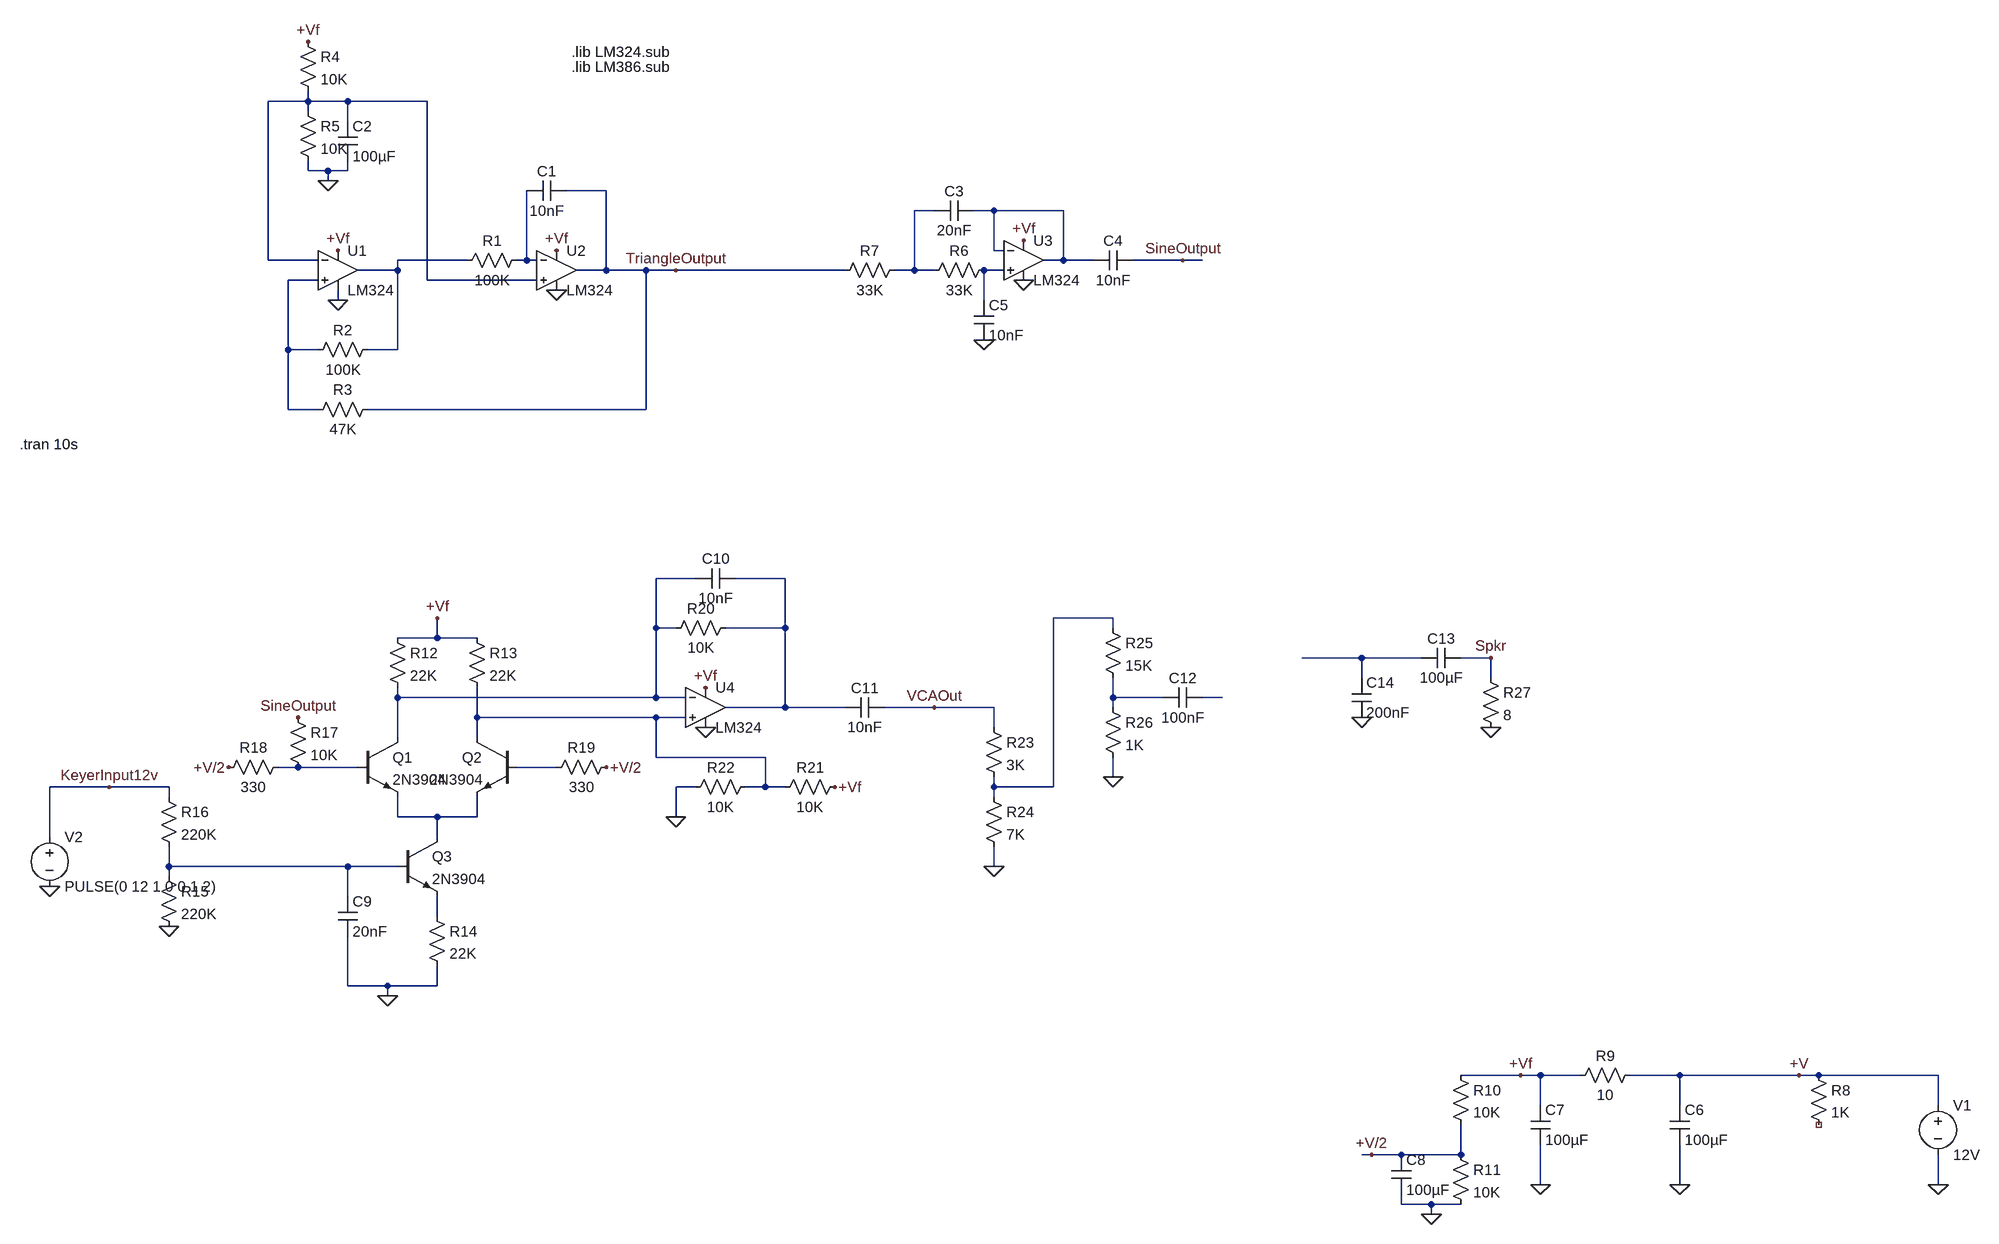
[diagram p0: schematic ClicklessOscilator.asc]
ClicklessOscilator.asc, the LTspice schematic file:
Version 4
SHEET 1 2764 1652
WIRE 32 -160 32 -176
WIRE 32 -160 -32 -160
WIRE 96 -160 32 -160
WIRE 224 -160 96 -160
WIRE 32 -144 32 -160
WIRE 96 -128 96 -160
WIRE 32 -48 32 -64
WIRE 64 -48 32 -48
WIRE 96 -48 96 -64
WIRE 96 -48 64 -48
WIRE 64 -32 64 -48
WIRE 512 -16 448 -16
WIRE 1040 16 1008 16
WIRE 1136 16 1104 16
WIRE 1248 16 1136 16
WIRE 1136 80 1136 16
WIRE 1152 80 1136 80
WIRE -32 96 -32 -160
WIRE 48 96 -32 96
WIRE 288 96 176 96
WIRE 384 96 384 -16
WIRE 384 96 368 96
WIRE 400 96 384 96
WIRE 1248 96 1248 16
WIRE 1248 96 1216 96
WIRE 1296 96 1248 96
WIRE 1440 96 1360 96
WIRE 1472 96 1440 96
WIRE 176 112 176 96
WIRE 176 112 112 112
WIRE 512 112 512 -16
WIRE 512 112 464 112
WIRE 576 112 512 112
WIRE 624 112 576 112
WIRE 896 112 624 112
WIRE 1008 112 1008 16
WIRE 1008 112 976 112
WIRE 1040 112 1008 112
WIRE 1152 112 1120 112
WIRE 48 128 0 128
WIRE 224 128 224 -160
WIRE 400 128 224 128
WIRE 80 160 80 144
WIRE 1120 160 1120 112
WIRE 0 240 0 128
WIRE 48 240 0 240
WIRE 176 240 176 112
WIRE 176 240 128 240
WIRE 0 336 0 240
WIRE 48 336 0 336
WIRE 576 336 576 112
WIRE 576 336 128 336
WIRE 656 608 592 608
WIRE 800 608 720 608
WIRE 1328 672 1232 672
WIRE 592 688 592 608
WIRE 624 688 592 688
WIRE 800 688 800 608
WIRE 800 688 704 688
WIRE 1328 688 1328 672
WIRE 240 704 240 672
WIRE 240 704 176 704
WIRE 304 704 240 704
WIRE 1728 736 1632 736
WIRE 1824 736 1728 736
WIRE 1936 736 1888 736
WIRE 1728 768 1728 736
WIRE 1936 768 1936 736
WIRE 176 800 176 784
WIRE 592 800 592 688
WIRE 592 800 176 800
WIRE 640 800 592 800
WIRE 1328 800 1328 768
WIRE 1408 800 1328 800
WIRE 1504 800 1472 800
WIRE 800 816 800 688
WIRE 800 816 704 816
WIRE 896 816 800 816
WIRE 1040 816 960 816
WIRE 1136 816 1040 816
WIRE 1328 816 1328 800
WIRE 304 832 304 784
WIRE 592 832 304 832
WIRE 640 832 592 832
WIRE 1136 848 1136 816
WIRE 176 864 176 800
WIRE 304 864 304 832
WIRE 592 896 592 832
WIRE 768 896 592 896
WIRE 16 912 -16 912
WIRE 112 912 16 912
WIRE 432 912 368 912
WIRE 1328 928 1328 896
WIRE -288 944 -384 944
WIRE -192 944 -288 944
WIRE 656 944 624 944
WIRE 768 944 768 896
WIRE 768 944 736 944
WIRE 800 944 768 944
WIRE 1136 944 1136 928
WIRE 1232 944 1232 672
WIRE 1232 944 1136 944
WIRE -192 960 -192 944
WIRE 1136 960 1136 944
WIRE 176 992 176 960
WIRE 240 992 176 992
WIRE 304 992 304 960
WIRE 304 992 240 992
WIRE 624 992 624 944
WIRE -384 1024 -384 944
WIRE 240 1024 240 992
WIRE -192 1072 -192 1040
WIRE 96 1072 -192 1072
WIRE 176 1072 96 1072
WIRE 1136 1072 1136 1040
WIRE -192 1088 -192 1072
WIRE 96 1120 96 1072
WIRE 240 1152 240 1120
WIRE 96 1264 96 1184
WIRE 160 1264 96 1264
WIRE 240 1264 240 1232
WIRE 240 1264 160 1264
WIRE 160 1280 160 1264
WIRE 1984 1408 1888 1408
WIRE 2016 1408 1984 1408
WIRE 2080 1408 2016 1408
WIRE 2240 1408 2160 1408
WIRE 2432 1408 2240 1408
WIRE 2464 1408 2432 1408
WIRE 2656 1408 2464 1408
WIRE 2016 1456 2016 1408
WIRE 2240 1456 2240 1408
WIRE 2656 1456 2656 1408
WIRE 1744 1536 1728 1536
WIRE 1792 1536 1744 1536
WIRE 1888 1536 1888 1488
WIRE 1888 1536 1792 1536
WIRE 2016 1584 2016 1520
WIRE 2240 1584 2240 1520
WIRE 2656 1584 2656 1536
WIRE 1792 1616 1792 1600
WIRE 1840 1616 1792 1616
WIRE 1888 1616 1840 1616
WIRE 1840 1632 1840 1616
FLAG 80 160 0
FLAG 80 80 +Vf
FLAG 1184 128 0
FLAG 1184 64 +Vf
FLAG 32 -256 +Vf
FLAG 64 -32 0
FLAG 624 112 TriangleOutput
FLAG 1120 224 0
FLAG 1440 96 SineOutput
FLAG 432 144 0
FLAG 432 80 +Vf
FLAG 2656 1584 0
FLAG 2240 1584 0
FLAG 2016 1584 0
FLAG 1840 1632 0
FLAG 2432 1408 +V
FLAG 1984 1408 +Vf
FLAG 1744 1536 +V/2
FLAG 240 672 +Vf
FLAG 160 1280 0
FLAG -288 944 KeyerInput12v
FLAG -192 1168 0
FLAG -384 1104 0
FLAG 16 832 SineOutput
FLAG -96 912 +V/2
FLAG 512 912 +V/2
FLAG 672 784 +Vf
FLAG 672 848 0
FLAG 1040 816 VCAOut
FLAG 880 944 +Vf
FLAG 624 992 0
FLAG 1136 1072 0
FLAG 1328 928 0
FLAG 1728 832 0
FLAG 1936 848 0
FLAG 1936 736 Spkr
SYMBOL Opamps\\opamp2 80 48 R0
SYMATTR InstName U1
SYMATTR Value LM324
SYMBOL Opamps\\opamp2 432 48 R0
SYMATTR InstName U2
SYMATTR Value LM324
SYMBOL res 384 80 R90
WINDOW 0 0 56 VBottom 2
WINDOW 3 32 56 VTop 2
SYMATTR InstName R1
SYMATTR Value 100K
SYMBOL res 144 224 R90
WINDOW 0 0 56 VBottom 2
WINDOW 3 32 56 VTop 2
SYMATTR InstName R2
SYMATTR Value 100K
SYMBOL res 144 320 R90
WINDOW 0 0 56 VBottom 2
WINDOW 3 32 56 VTop 2
SYMATTR InstName R3
SYMATTR Value 47K
SYMBOL cap 448 -32 R90
WINDOW 0 0 32 VBottom 2
WINDOW 3 32 32 VTop 2
SYMATTR InstName C1
SYMATTR Value 10nF
SYMBOL res 16 -272 R0
SYMATTR InstName R4
SYMATTR Value 10K
SYMBOL res 16 -160 R0
SYMATTR InstName R5
SYMATTR Value 10K
SYMBOL cap 80 -128 R0
SYMATTR InstName C2
SYMATTR Value 100µF
SYMBOL voltage 2656 1440 R0
WINDOW 123 0 0 Left 2
WINDOW 39 0 0 Left 2
SYMATTR InstName V1
SYMATTR Value 12V
SYMBOL Opamps\\opamp2 1184 32 R0
SYMATTR InstName U3
SYMATTR Value LM324
SYMBOL res 1136 96 R90
WINDOW 0 0 56 VBottom 2
WINDOW 3 32 56 VTop 2
SYMATTR InstName R6
SYMATTR Value 33K
SYMBOL res 992 96 R90
WINDOW 0 0 56 VBottom 2
WINDOW 3 32 56 VTop 2
SYMATTR InstName R7
SYMATTR Value 33K
SYMBOL cap 1104 0 R90
WINDOW 0 0 32 VBottom 2
WINDOW 3 32 32 VTop 2
SYMATTR InstName C3
SYMATTR Value 20nF
SYMBOL cap 1360 80 R90
WINDOW 0 0 32 VBottom 2
WINDOW 3 32 32 VTop 2
SYMATTR InstName C4
SYMATTR Value 10nF
SYMBOL cap 1104 160 R0
SYMATTR InstName C5
SYMATTR Value 10nF
SYMBOL res 2448 1392 R0
SYMATTR InstName R8
SYMATTR Value 1K
SYMBOL cap 2224 1456 R0
SYMATTR InstName C6
SYMATTR Value 100µF
SYMBOL res 2176 1392 R90
WINDOW 0 0 56 VBottom 2
WINDOW 3 32 56 VTop 2
SYMATTR InstName R9
SYMATTR Value 10
SYMBOL cap 2000 1456 R0
SYMATTR InstName C7
SYMATTR Value 100µF
SYMBOL res 1872 1392 R0
SYMATTR InstName R10
SYMATTR Value 10K
SYMBOL res 1872 1520 R0
SYMATTR InstName R11
SYMATTR Value 10K
SYMBOL cap 1776 1536 R0
SYMATTR InstName C8
SYMATTR Value 100µF
SYMBOL npn 112 864 R0
SYMATTR InstName Q1
SYMATTR Value 2N3904
SYMBOL npn 368 864 M0
SYMATTR InstName Q2
SYMATTR Value 2N3904
SYMBOL npn 176 1024 R0
SYMATTR InstName Q3
SYMATTR Value 2N3904
SYMBOL res 160 688 R0
SYMATTR InstName R12
SYMATTR Value 22K
SYMBOL res 288 688 R0
SYMATTR InstName R13
SYMATTR Value 22K
SYMBOL res 224 1136 R0
SYMATTR InstName R14
SYMATTR Value 22K
SYMBOL cap 80 1120 R0
SYMATTR InstName C9
SYMATTR Value 20nF
SYMBOL res -208 1072 R0
SYMATTR InstName R15
SYMATTR Value 220K
SYMBOL res -208 944 R0
SYMATTR InstName R16
SYMATTR Value 220K
SYMBOL voltage -384 1008 R0
WINDOW 123 0 0 Left 2
WINDOW 39 0 0 Left 2
SYMATTR InstName V2
SYMATTR Value PULSE(0 12 1 0 0 1 2)
SYMBOL res 0 816 R0
SYMATTR InstName R17
SYMATTR Value 10K
SYMBOL res 0 896 R90
WINDOW 0 0 56 VBottom 2
WINDOW 3 32 56 VTop 2
SYMATTR InstName R18
SYMATTR Value 330
SYMBOL res 528 896 R90
WINDOW 0 0 56 VBottom 2
WINDOW 3 32 56 VTop 2
SYMATTR InstName R19
SYMATTR Value 330
SYMBOL Opamps\\opamp2 672 752 R0
SYMATTR InstName U4
SYMATTR Value LM324
SYMBOL res 720 672 R90
WINDOW 0 0 56 VBottom 2
WINDOW 3 32 56 VTop 2
SYMATTR InstName R20
SYMATTR Value 10K
SYMBOL cap 720 592 R90
WINDOW 0 0 32 VBottom 2
WINDOW 3 32 32 VTop 2
SYMATTR InstName C10
SYMATTR Value 10nF
SYMBOL cap 960 800 R90
WINDOW 0 0 32 VBottom 2
WINDOW 3 32 32 VTop 2
SYMATTR InstName C11
SYMATTR Value 10nF
SYMBOL res 896 928 R90
WINDOW 0 0 56 VBottom 2
WINDOW 3 32 56 VTop 2
SYMATTR InstName R21
SYMATTR Value 10K
SYMBOL res 752 928 R90
WINDOW 0 0 56 VBottom 2
WINDOW 3 32 56 VTop 2
SYMATTR InstName R22
SYMATTR Value 10K
SYMBOL res 1120 832 R0
SYMATTR InstName R23
SYMATTR Value 3K
SYMBOL res 1120 944 R0
SYMATTR InstName R24
SYMATTR Value 7K
SYMBOL res 1312 672 R0
SYMATTR InstName R25
SYMATTR Value 15K
SYMBOL res 1312 800 R0
SYMATTR InstName R26
SYMATTR Value 1K
SYMBOL cap 1472 784 R90
WINDOW 0 0 32 VBottom 2
WINDOW 3 32 32 VTop 2
SYMATTR InstName C12
SYMATTR Value 100nF
SYMBOL cap 1888 720 R90
WINDOW 0 0 32 VBottom 2
WINDOW 3 32 32 VTop 2
SYMATTR InstName C13
SYMATTR Value 100µF
SYMBOL cap 1712 768 R0
SYMATTR InstName C14
SYMATTR Value 200nF
SYMBOL res 1920 752 R0
SYMATTR InstName R27
SYMATTR Value 8
TEXT -432 392 Left 2 !.tran 10s
TEXT 456 -240 Left 2 !.lib LM324.sub
TEXT 456 -216 Left 2 !.lib LM386.sub

The netlist it stands for:
* ClicklessOscilator.asc
XU1 N007 N001 +Vf 0 N004 LM324  ; pins In+ In- V+ V- OUT
XU2 N001 N005 +Vf 0 TriangleOutput LM324  ; pins In+ In- V+ V- OUT
R1 N005 N004 100K
R2 N004 N007 100K
R3 TriangleOutput N007 47K
C1 TriangleOutput N005 10nF
R4 +Vf N001 10K
R5 N001 0 10K
C2 N001 0 100µF
V1 +V 0 12V
XU3 N006 N003 +Vf 0 N003 LM324  ; pins In+ In- V+ V- OUT
R6 N006 N002 33K
R7 N002 TriangleOutput 33K
C3 N003 N002 20nF
C4 SineOutput N003 10nF
C5 N006 0 10nF
R8 +V NC_01 1K
C6 +V 0 100µF
R9 +V +Vf 10
C7 +Vf 0 100µF
R10 +Vf +V/2 10K
R11 +V/2 0 10K
C8 +V/2 0 100µF
Q1 N008 N015 N017 0 2N3904
Q2 N014 N016 N017 0 2N3904
Q3 N017 N018 N019 0 2N3904
R12 +Vf N008 22K
R13 +Vf N014 22K
R14 N019 0 22K
C9 N018 0 20nF
R15 N018 0 220K
R16 KeyerInput12v N018 220K
V2 KeyerInput12v 0 PULSE(0 12 1 0 0 1 2)
R17 SineOutput N015 10K
R18 N015 +V/2 330
R19 +V/2 N016 330
XU4 N014 N008 +Vf 0 N009 LM324  ; pins In+ In- V+ V- OUT
R20 N009 N008 10K
C10 N009 N008 10nF
C11 VCAOut N009 10nF
R21 +Vf N014 10K
R22 N014 0 10K
R23 VCAOut N010 3K
R24 N010 0 7K
R25 N010 N012 15K
R26 N012 0 1K
C12 N013 N012 100nF
C13 Spkr N011 100µF
C14 N011 0 200nF
R27 Spkr 0 8
.model NPN NPN
.model PNP PNP
.lib standard.bjt
.tran 10s
.lib LM324.sub
.lib LM386.sub
.backanno
.end